# EAGLE design TCO v3 (EAGLE 7.2.0)
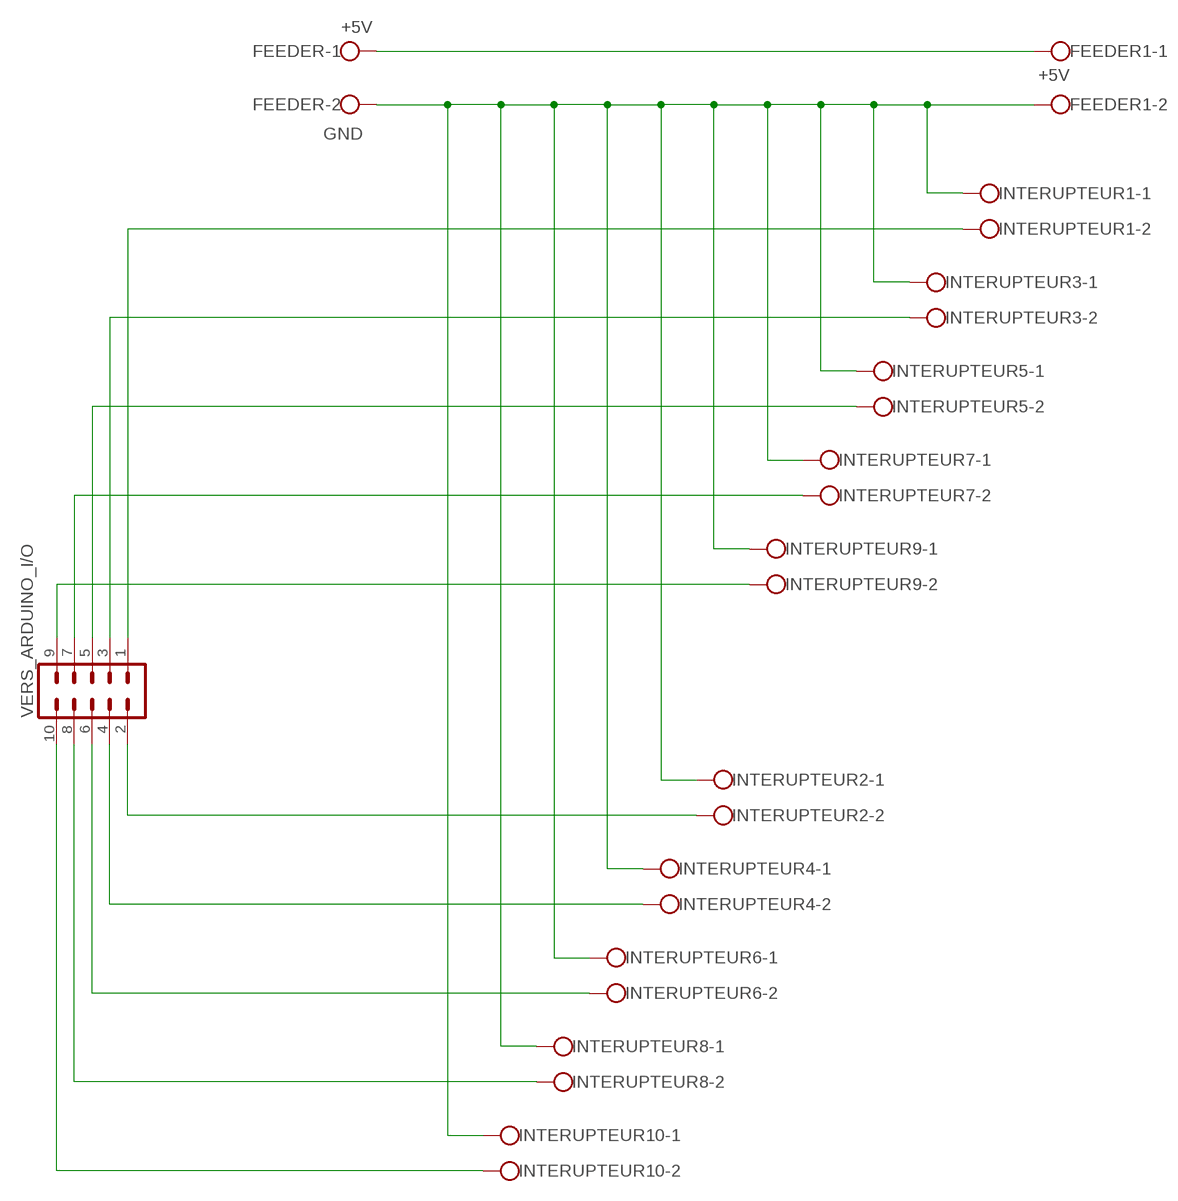
[diagram p0: schematic, sheet 1]

## Parts
FEEDER  W237-102  [W237-102]
FEEDER1  W237-102  [W237-102]
INTERUPTEUR1  W237-102  [W237-102]
INTERUPTEUR2  W237-102  [W237-102]
INTERUPTEUR3  W237-102  [W237-102]
INTERUPTEUR4  W237-102  [W237-102]
INTERUPTEUR5  W237-102  [W237-102]
INTERUPTEUR6  W237-102  [W237-102]
INTERUPTEUR7  W237-102  [W237-102]
INTERUPTEUR8  W237-102  [W237-102]
INTERUPTEUR9  W237-102  [W237-102]
INTERUPTEUR10  W237-102  [W237-102]
VERS_ARDUINO_I/O  MA05-2  [MA05-2]

## Nets
N$1: FEEDER1.1 FEEDER.1
N$2: INTERUPTEUR1.2 VERS_ARDUINO_I/O.1
N$3: INTERUPTEUR3.2 VERS_ARDUINO_I/O.3
N$4: INTERUPTEUR5.2 VERS_ARDUINO_I/O.5
N$5: INTERUPTEUR7.2 VERS_ARDUINO_I/O.7
N$6: INTERUPTEUR9.2 VERS_ARDUINO_I/O.9
N$7: INTERUPTEUR2.2 VERS_ARDUINO_I/O.2
N$8: INTERUPTEUR4.2 VERS_ARDUINO_I/O.4
N$9: INTERUPTEUR6.2 VERS_ARDUINO_I/O.6
N$10: INTERUPTEUR8.2 VERS_ARDUINO_I/O.8
N$11: INTERUPTEUR10.2 VERS_ARDUINO_I/O.10
N$26: FEEDER1.2 FEEDER.2 INTERUPTEUR1.1 INTERUPTEUR2.1 INTERUPTEUR3.1 INTERUPTEUR4.1 INTERUPTEUR5.1 INTERUPTEUR6.1 INTERUPTEUR7.1 INTERUPTEUR8.1 INTERUPTEUR9.1 INTERUPTEUR10.1

## Library data of the parts
FEEDER FEEDER1 INTERUPTEUR1-INTERUPTEUR10 = con-wago-500:W237-102: WAGO SCREW CLAMP; MPN: 237-102; OC_FARNELL: unknown; OC_NEWARK: 70K9898; PIN-1: +5V; PIN-2: GND
VERS_ARDUINO_I/O = con-lstb:MA05-2: PIN HEADER; OC_FARNELL: unknown; OC_NEWARK: unknown

## Board
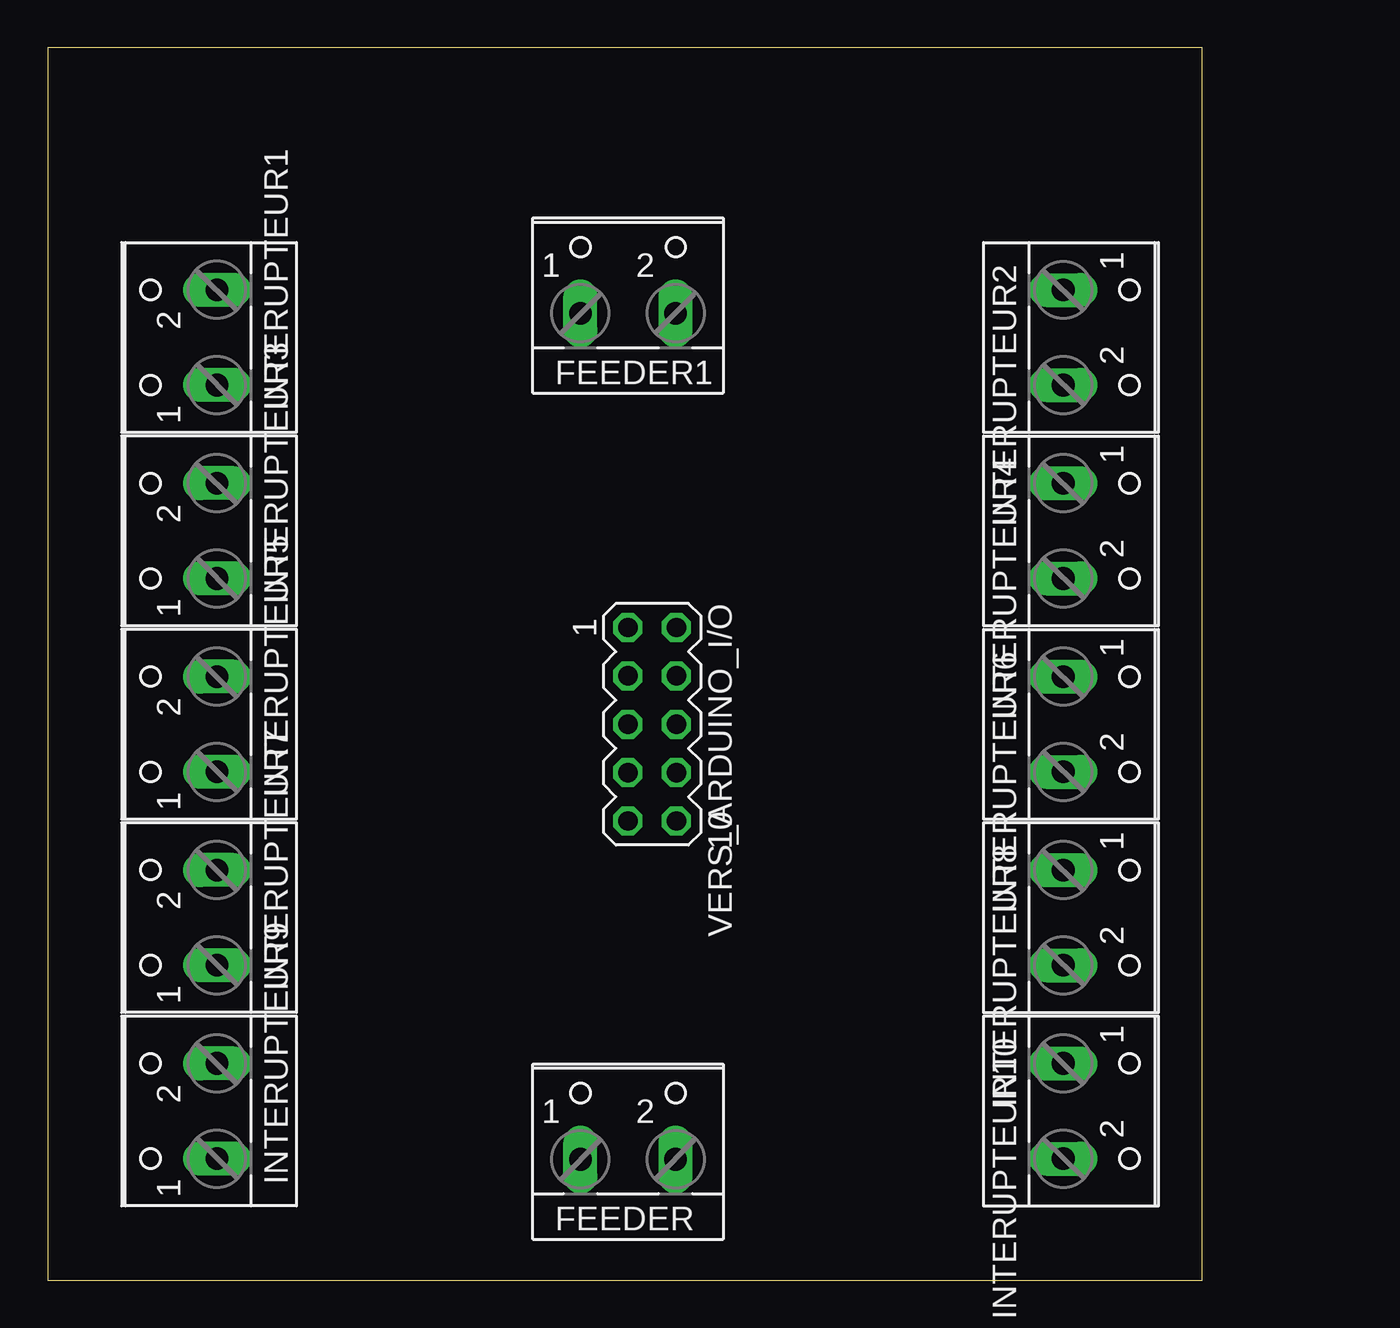
[diagram p1: board, top side]
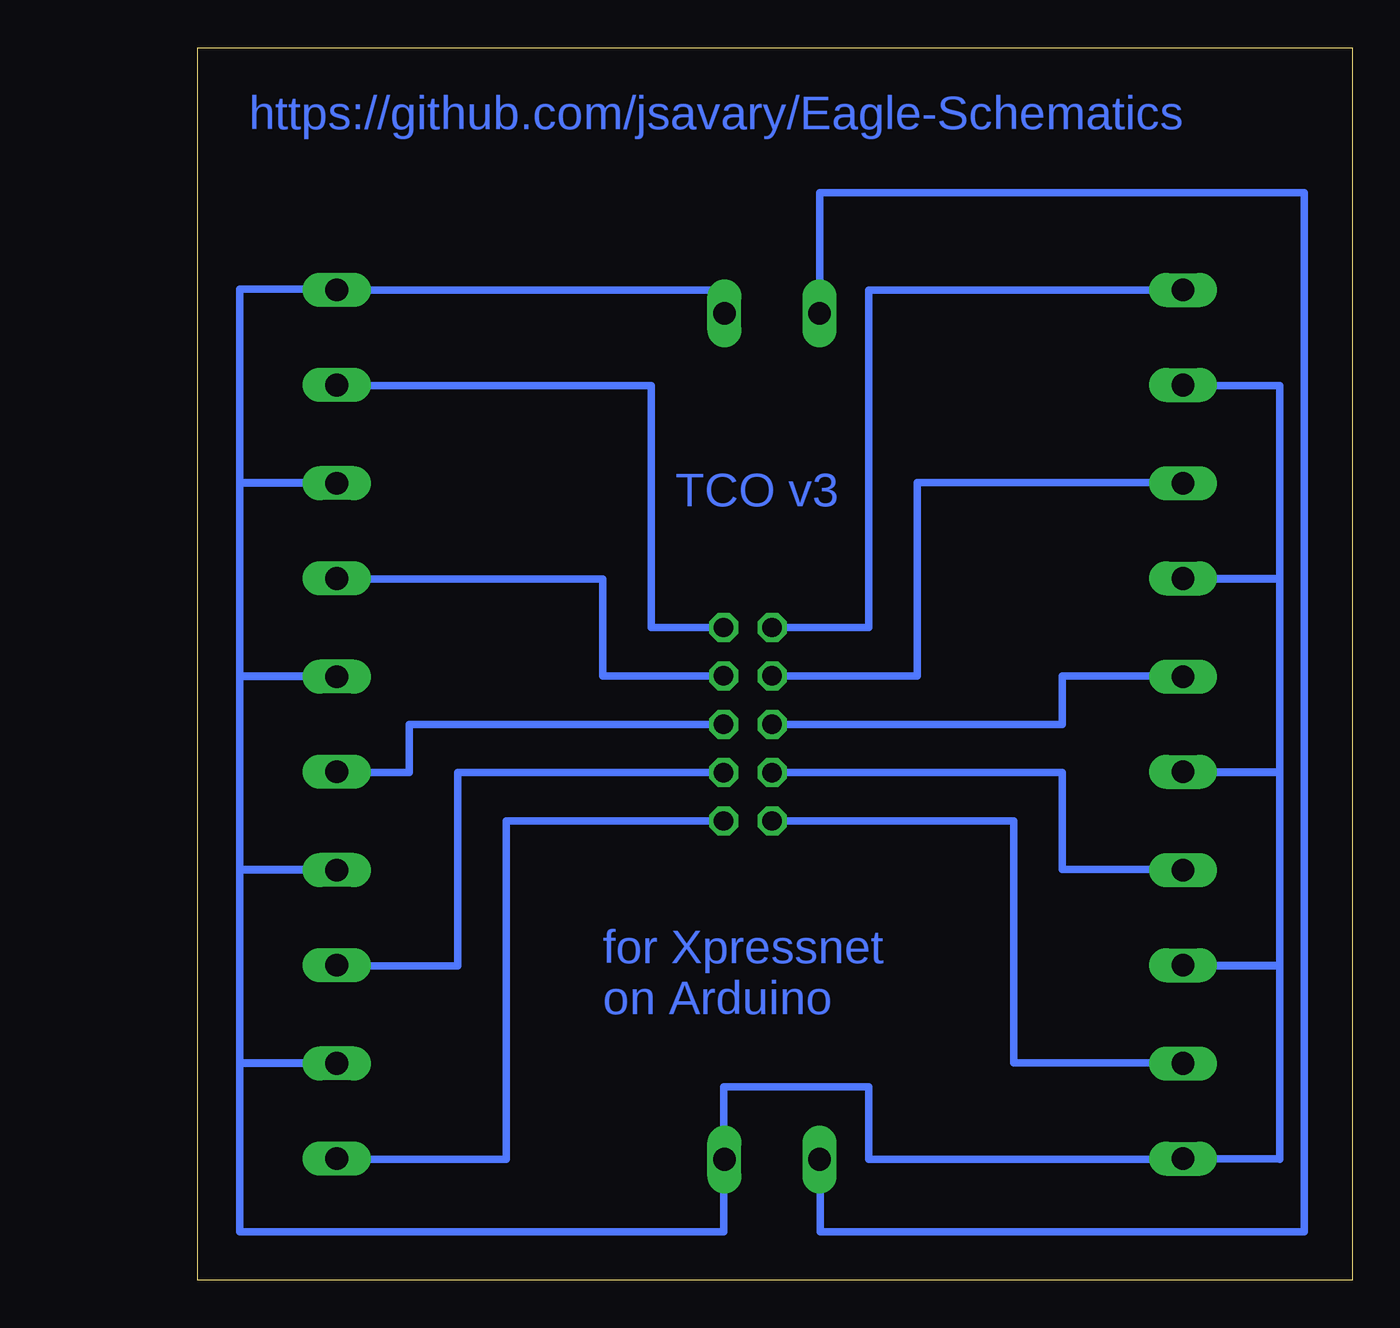
[diagram p2: board, bottom side, seen from below]

Size 60.63 x 64.76 mm. Coordinates in mm from the lower left corner, seen from the top.
Outline: 0,0 60.63,0 60.63,64.76 0,64.76 0,0
Copper layers (1*16): Top 0.035mm / dielectric 1.5mm / Bottom 0.035mm
Design rules "default": minimum track width 10mil, minimum drill 24mil, track to track 8mil, track to pad 8mil, pad to pad 8mil, via to via 8mil, smd to smd 8mil, copper to edge 40mil, drill to drill 8mil, minimum pad ring 10mil, minimum via ring 8mil, stop-mask expansion 4mil, vias tented up to drill 0mil, thermal gap 10mil

### Footprints (pad centres in the part's own frame; a part is rotated, then mirrored left to right if it is on the bottom)
W237-102 = drill 1.194 long: 1 -2.5,-1.27; 2 2.5,-1.27
MA05-2 = drill 1.016 octagon: 1 -5.08,-1.27; 2 -5.08,1.27; 3 -2.54,-1.27; 4 -2.54,1.27; 5 0,-1.27; 6 0,1.27; 7 2.54,-1.27; 8 2.54,1.27; 9 5.08,-1.27; 10 5.08,1.27

### Placement (x,y rotation side)
FEEDER  30.48,7.62 0 top
FEEDER1  30.48,52.07 0 top
INTERUPTEUR1  7.62,49.53 90 top
INTERUPTEUR2  54.61,49.53 270 top
INTERUPTEUR3  7.62,39.37 90 top
INTERUPTEUR4  54.61,39.37 270 top
INTERUPTEUR5  7.62,29.21 90 top
INTERUPTEUR6  54.61,29.21 270 top
INTERUPTEUR7  7.62,19.05 90 top
INTERUPTEUR8  54.61,19.05 270 top
INTERUPTEUR9  7.62,8.89 90 top
INTERUPTEUR10  54.61,8.89 270 top
VERS_ARDUINO_I/O  31.75,29.21 270 top

### Tracks (layer width: path | path; a pad name or v marks a point on that pad's centre or on a via)
N$1
  Bottom 0.406: FEEDER.1 27.94,6.35 27.94,2.54 2.54,2.54 2.54,57.15 27.98,57.15 FEEDER1.1
N$2
  Bottom 0.406: INTERUPTEUR1.2 25.4,52.03 25.4,34.29 VERS_ARDUINO_I/O.1
N$3
  Bottom 0.406: VERS_ARDUINO_I/O.3 22.86,31.75 22.86,41.91 8.89,41.91 INTERUPTEUR3.2
N$4
  Bottom 0.406: VERS_ARDUINO_I/O.5 15.24,29.21 15.24,31.75 8.89,31.75 INTERUPTEUR5.2
N$5
  Bottom 0.406: VERS_ARDUINO_I/O.7 15.24,26.67 15.24,21.59 8.89,21.59 INTERUPTEUR7.2
N$6
  Bottom 0.406: VERS_ARDUINO_I/O.9 17.78,24.13 17.78,11.43 8.89,11.43 INTERUPTEUR9.2
N$7
  Bottom 0.406: VERS_ARDUINO_I/O.2 36.83,34.29 36.83,46.99 53.34,46.99 INTERUPTEUR2.2
N$8
  Bottom 0.406: VERS_ARDUINO_I/O.4 39.37,31.75 39.37,36.83 53.34,36.83 INTERUPTEUR4.2
N$9
  Bottom 0.406: VERS_ARDUINO_I/O.6 49.53,29.21 49.53,26.67 53.34,26.67 INTERUPTEUR6.2
N$10
  Bottom 0.406: VERS_ARDUINO_I/O.8 46.99,26.67 46.99,16.51 53.34,16.51 INTERUPTEUR8.2
N$11
  Bottom 0.406: VERS_ARDUINO_I/O.10 44.45,24.13 44.45,6.35 53.34,6.35 INTERUPTEUR10.2
N$26
  Bottom 0.406: FEEDER1.2 32.98,52.07 33.02,52.07 33.02,52.03 INTERUPTEUR2.1 53.34,52.07 58.42,52.07 58.42,41.87 INTERUPTEUR4.1 53.34,41.91 58.42,41.91 58.42,31.71 INTERUPTEUR6.1 53.34,31.75 58.42,31.75 58.42,21.55 INTERUPTEUR8.1 53.34,21.59 58.42,21.59 58.42,11.39 INTERUPTEUR10.1 53.34,11.43 58.42,11.43 58.42,2.54 33.02,2.54 33.02,6.35 | FEEDER.2 33.02,6.35 | 33.02,6.35 33.02,10.16 25.4,10.16 25.4,6.35 8.89,6.35 INTERUPTEUR9.1 3.81,6.39 | 3.81,6.39 3.81,6.35 | 3.81,6.39 3.81,16.51 8.89,16.51 INTERUPTEUR7.1 3.81,16.55 3.81,26.67 8.89,26.67 INTERUPTEUR5.1 3.81,26.71 3.81,36.83 8.89,36.83 INTERUPTEUR3.1 3.81,36.87 3.81,46.99 8.89,46.99 INTERUPTEUR1.1

### Text on the board
Bottom: https://github.com/jsavary/Eagle-Schematics | TCO v3 | for Xpressnet / on Arduino